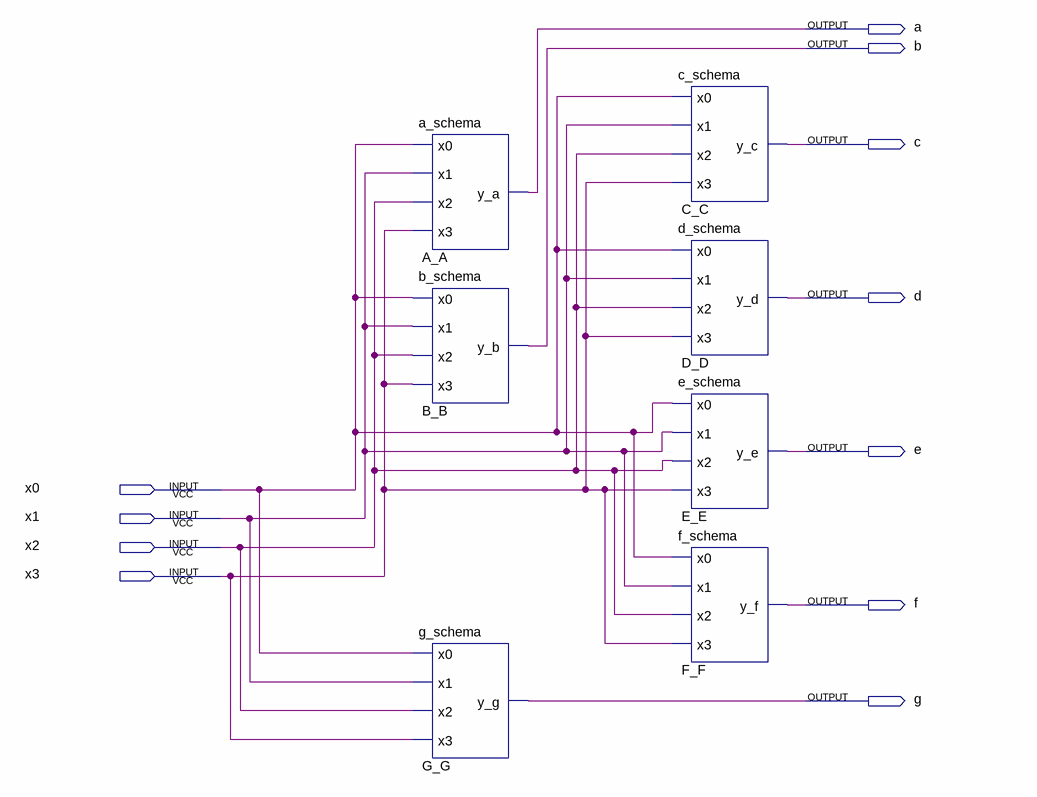
[diagram p0: schematic sheet]
// Quartus schematic BCD_schema.bdf as structural Verilog: 7 symbols, 11 pins
module BCD_schema (
  input  x0,
  input  x1,
  input  x2,
  input  x3,
  output a,
  output b,
  output c,
  output d,
  output e,
  output f,
  output g
);

  a_schema A_A (.x0(x0), .x1(x1), .x2(x2), .x3(x3), .y_a(a));
  b_schema B_B (.x0(x0), .x1(x1), .x2(x2), .x3(x3), .y_b(b));
  g_schema G_G (.x0(x0), .x1(x1), .x2(x2), .x3(x3), .y_g(g));
  c_schema C_C (.x0(x0), .x1(x1), .x2(x2), .x3(x3), .y_c(c));
  d_schema D_D (.x0(x0), .x1(x1), .x2(x2), .x3(x3), .y_d(d));
  e_schema E_E (.x0(x0), .x1(x1), .x2(x2), .x3(x3), .y_e(e));
  f_schema F_F (.x0(x0), .x1(x1), .x2(x2), .x3(x3), .y_f(f));
endmodule
